# EAGLE design DisplayArray (EAGLE 9.6.2)

## Sheet 1 of 2
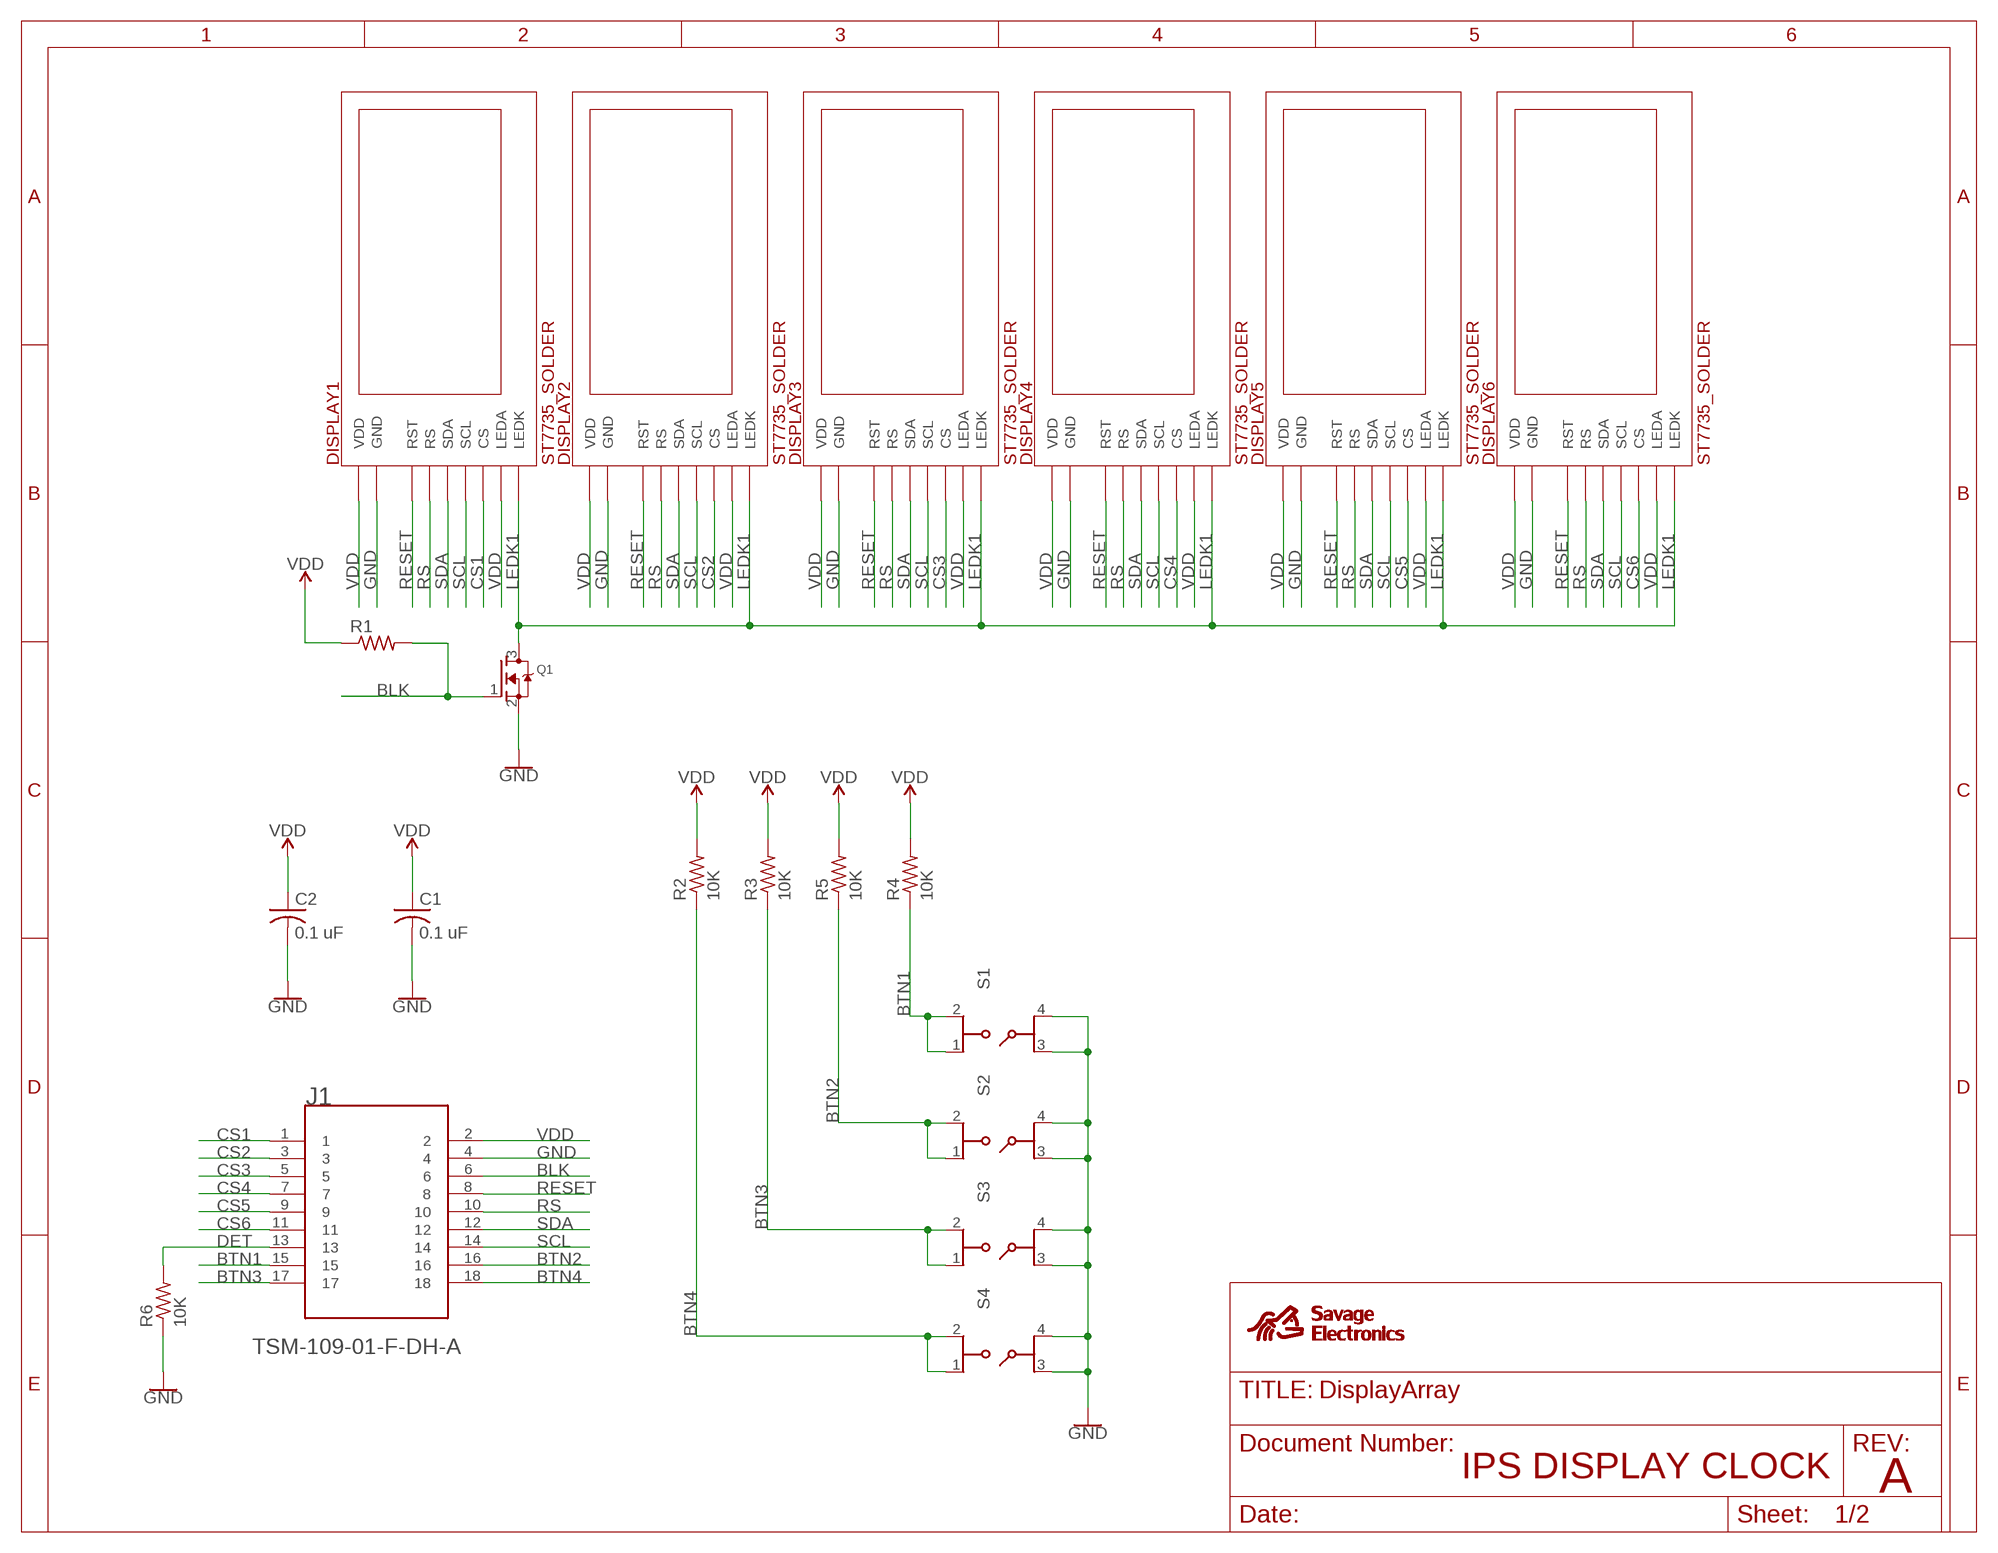
[diagram p0: schematic, sheet 1]

### Parts
C1  0.1 uF  C-USC0603  [C0603]
C2  0.1 uF  C-USC0603  [C0603]
DISPLAY1  ST7735_SOLDER  [IPSLCD096_SOLDER]
DISPLAY2  ST7735_SOLDER  [IPSLCD096_SOLDER]
DISPLAY3  ST7735_SOLDER  [IPSLCD096_SOLDER]
DISPLAY4  ST7735_SOLDER  [IPSLCD096_SOLDER]
DISPLAY5  ST7735_SOLDER  [IPSLCD096_SOLDER]
DISPLAY6  ST7735_SOLDER  [IPSLCD096_SOLDER]
J1  TSM-109-01-F-DH-A  SAMTEC-TSM-109-02-X-DH-AJ  [SAMTEC-TSM-109-02-X-DH-A]
Q1  MOSFET-NREFLOW  [SOT23]
R1  R-US_R0805  [R0805]
R2  10K  R-US_R0805  [R0805]
R3  10K  R-US_R0805  [R0805]
R4  10K  R-US_R0805  [R0805]
R5  10K  R-US_R0805  [R0805]
R6  10K  R-US_R0805  [R0805]
S1  434123025826  [434123025826]
S2  434123025826  [434123025826]
S3  434123025826  [434123025826]
S4  434123025826  [434123025826]
U$3  SE_SMALL_SILK  [SE_SMALL_SILK]

### Nets
BLK: J1.6 Q1.1(G) R1.2
BTN1: J1.15 R4.1 S1.1 S1.2
BTN2: J1.16 R5.1 S2.1 S2.2
BTN3: J1.17 R3.1 S3.1 S3.2
BTN4: J1.18 R2.1 S4.1 S4.2
CS1: DISPLAY1.7(CS) J1.1
CS2: DISPLAY2.7(CS) J1.3
CS3: DISPLAY3.7(CS) J1.5
CS4: DISPLAY4.7(CS) J1.7
CS5: DISPLAY5.7(CS) J1.9
CS6: DISPLAY6.7(CS) J1.11
DET: J1.13 R6.2
GND: C1.2 C2.2 DISPLAY1.8(GND) DISPLAY1.13(GND) DISPLAY2.8(GND) DISPLAY2.13(GND) DISPLAY3.8(GND) DISPLAY3.13(GND) DISPLAY4.8(GND) DISPLAY4.13(GND) DISPLAY5.8(GND) DISPLAY5.13(GND) DISPLAY6.8(GND) DISPLAY6.13(GND) J1.4 Q1.2(S) R6.1 S1.3 S1.4 S2.3 S2.4 S3.3 S3.4 S4.3 S4.4
LEDK1: DISPLAY1.11(LEDK) DISPLAY2.11(LEDK) DISPLAY3.11(LEDK) DISPLAY4.11(LEDK) DISPLAY5.11(LEDK) DISPLAY6.11(LEDK) Q1.3(D)
RESET: DISPLAY1.6(RST) DISPLAY2.6(RST) DISPLAY3.6(RST) DISPLAY4.6(RST) DISPLAY5.6(RST) DISPLAY6.6(RST) J1.8
RS: DISPLAY1.5(RS) DISPLAY2.5(RS) DISPLAY3.5(RS) DISPLAY4.5(RS) DISPLAY5.5(RS) DISPLAY6.5(RS) J1.10
SCL: DISPLAY1.4(SCL) DISPLAY2.4(SCL) DISPLAY3.4(SCL) DISPLAY4.4(SCL) DISPLAY5.4(SCL) DISPLAY6.4(SCL) J1.14
SDA: DISPLAY1.3(SDA) DISPLAY2.3(SDA) DISPLAY3.3(SDA) DISPLAY4.3(SDA) DISPLAY5.3(SDA) DISPLAY6.3(SDA) J1.12
VDD: C1.1 C2.1 DISPLAY1.10(VDD) DISPLAY1.12(LEDA) DISPLAY2.10(VDD) DISPLAY2.12(LEDA) DISPLAY3.10(VDD) DISPLAY3.12(LEDA) DISPLAY4.10(VDD) DISPLAY4.12(LEDA) DISPLAY5.10(VDD) DISPLAY5.12(LEDA) DISPLAY6.10(VDD) DISPLAY6.12(LEDA) J1.2 R1.1 R2.2 R3.2 R4.2 R5.2

### Notes on the sheet
- IPS DISPLAY CLOCK
- A

## Sheet 2 of 2

## Library data of the parts
C1 C2 = Adafruit:C-US: CAPACITOR, American symbol
DISPLAY1-DISPLAY6 = IPSLCD:ST7735_SOLDER
J1 = TSM-109-02-X-DH-A:SAMTEC-TSM-109-02-X-DH-A
Q1 = Adafruit:MOSFET-N: N-Channel Mosfet 2N7002E - 60V 260mA SOT23 [Digikey: 2N7002ET1GOSTR-ND] - REEL BSH103 - 30V 850mA SOT23 [Digikey: 568-5013-1-ND]
R1-R6 = Adafruit:R-US_: RESISTOR, American symbol
S1-S4 = Eagle_SWITCHES (rev18c):434123025826: 4.2 x 3.2 mm J-Bend SMD Tact Switch WS-TASV MATERIAL PROPERTIES: Cover Material Stainless Steel Actuator Material LCP Actuator Flammability Rating UL94 V-0 Actuator Color White;​ Black Frame Material LCP Frame Flammability Rating UL94 V-0 Frame Color Black Contact Material Stainless Steel Contact Plating Silver Terminal Material Copper Alloy Terminal Plating Silver ELECTRICAL PROPERTIES: Rated Current [1] 50 mA Rated Voltage 16 V (DC) Contact Resistance Initial 500 mΩ Contact Resistance After Life Test 1 Ω Insulation Resistance 100 MΩ Withstanding Voltage 250 V (AC) Bounce 10 ms MECHANICAL PROPERTIES: Operation Force 260 g;​ 160 g Life Cycle 50000 Times;​ 100000 Times GENERAL INFORMATION: Operating Temperature -40 °C up to +85 °C Storage Temperature (in original packaging) -40 °C up to +85 °C PACKAGING PROPERTIES: Packaging Tape and Reel Packaging Unit (Qty.) 2900 <http://katalog.we-online.de/media/images/v2/Family_WS-TASV-4341x30258x6_Gruppe.jpg> Details see: http://katalog.we-online.de/em/datasheet/434123025826.pdf 2017(C) Wurth Elektronik
U$3 = SE_NEWLOGO:SE_SMALL_SILK

## Board
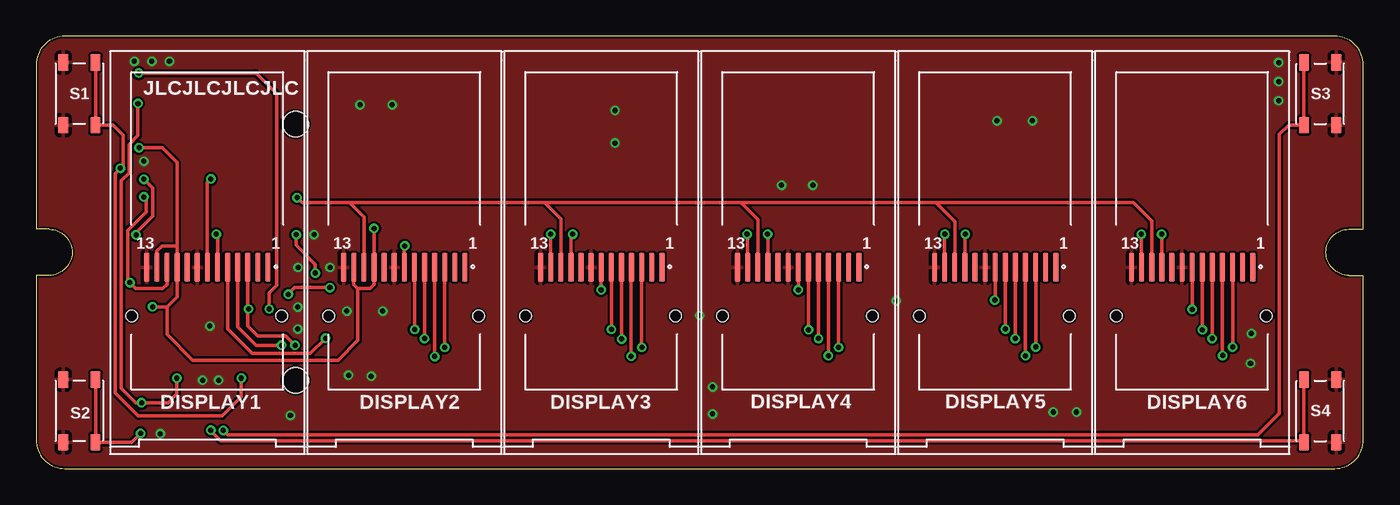
[diagram p1: board, top side]
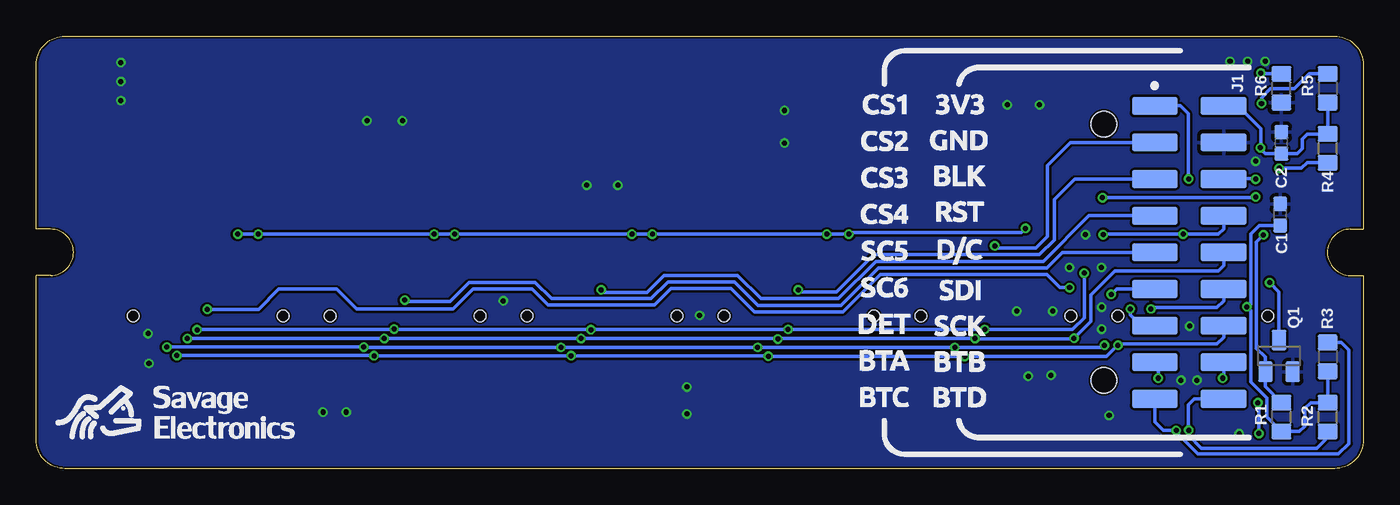
[diagram p2: board, bottom side, seen from below]

Size 92 x 30 mm. Coordinates in mm from the lower left corner, seen from the top.
Outline: 2,0 90,0 arc90 92,2 92,13.4 91,13.4 arc-180 91,16.6 92,16.6 92,28 arc90 90,30 2,30 arc90 0,28 0,16.6 0.9,16.6 arc-180 0.9,13.4 0,13.4 0,2 arc90 2,0
Copper layers (1*16): Top 0.035mm / dielectric 1.5mm / Bottom 0.035mm
Design rules "default *": minimum track width 5mil, minimum drill 0.3mm, track to track 6mil, track to pad 5mil, pad to pad 5mil, via to via 5mil, smd to smd 5mil, copper to edge 6mil, drill to drill 6mil, minimum pad ring 10mil, minimum via ring 6mil, stop-mask expansion 2mil, vias tented up to drill 20mil, thermal gap 10mil

### Footprints (pad centres in the part's own frame; a part is rotated, then mirrored left to right if it is on the bottom)
C0603 = smd 0.965 x 0.965: 1 -0.748,0; 2 0.748,0
IPSLCD096_SOLDER = smd 2 x 0.35: 1 12.96,2.55; 2 12.96,3.25; 3 12.96,3.95; 4 12.96,4.65; 5 12.96,5.35; 6 12.96,6.05; 7 12.96,6.75; 8 12.96,7.45; 9 12.96,8.15; 10 12.96,8.85; 11 12.96,9.55; 12 12.96,10.25; 13 12.96,10.95 | hole 0.8: 9.6,12; 9.6,1.6
SAMTEC-TSM-109-02-X-DH-A = smd 1.27 x 3.18: 1 -10.16,3.543; 2 -10.16,8.306; 3 -7.62,3.543; 4 -7.62,8.306; 5 -5.08,3.543; 6 -5.08,8.306; 7 -2.54,3.543; 8 -2.54,8.306; 9 0,3.543; 10 0,8.306; 11 2.54,3.543; 12 2.54,8.306; 13 5.08,3.543; 14 5.08,8.306; 15 7.62,3.543; 16 7.62,8.306; 17 10.16,3.543; 18 10.16,8.306 | hole 1.78: 8.89,0; -8.89,0
SOT23 = smd 1 x 1.4: 1 -0.95,-1.1; 2 0.95,-1.1; 3 0,1.1
R0805 = smd 1.1 x 1.4: 1 -1,0; 2 1,0
434123025826 = smd 1.168 x 0.711: 1 -2.175,1.121; 2 2.175,1.121; 3 -2.175,-1.121; 4 2.175,-1.121

### Placement (x,y rotation side)
C1  5.77,17.61 90 bottom
C2  5.69,22.59 90 bottom
DISPLAY1  18.62,1 90 top
DISPLAY2  32.27,1 90 top
DISPLAY3  45.92,1 90 top
DISPLAY4  59.58,1 90 top
DISPLAY5  73.22,1 90 top
DISPLAY6  86.88,1 90 top
J1  18,15 270 bottom
Q1  5.85,7.82 0 bottom
R1  5.68,3.57 90 bottom
R2  2.47,3.57 90 bottom
R3  2.47,7.75 270 bottom
R4  2.47,22.21 90 bottom
R5  2.47,26.38 270 bottom
R6  5.69,26.38 90 bottom
S1  3,26 270 top
S2  3,4 270 top
S3  89,26 90 top
S4  89,4 90 top
U$3  82.2,3.9 0 bottom

### Tracks (layer width: path | path; a pad name or v marks a point on that pad's centre or on a via)
BLK  (via drill 0.35)
  Top 0.254: v6.93,16.2 6.93,16.38 8.08,17.53 8.08,19.46 v7.47,20.07
  Bottom 0.254: J1.6 9.66,20.12 7.52,20.12 v7.47,20.07 | v6.93,16.2 7.42,15.72 7.42,8.35 6.8,7.73 Q1.1 6.8,5.69 R1.2
BTN1  (via drill 0.35)
  Top 0.254: v14.22,6.27 14.22,4.98 12.9,3.66 7.09,3.66 5.49,5.26 5.49,20.47 v5.84,20.83 6.04,21.03 6.04,23.11 5.33,23.82 S1.2 S1.1
  Bottom 0.254: v5.84,20.83 4.29,20.83 3.91,21.21 R4.1 | R4.1 | v14.22,6.27 14.22,7.32 14.16,7.38 J1.15
BTN2  (via drill 0.35)
  Top 0.254: v9.75,6.27 9.75,5.18 9.14,4.57 v7.32,4.57 6.91,4.57 5.92,5.56 5.92,19.96 6.45,20.5 6.45,22.48 7.06,23.09 v7.06,25.32 | S2.1 S2.2 6.63,1.82 v7.24,2.44
  Bottom 0.254: J1.16 9.69,6.33 v9.75,6.27 | R5.1 3.76,27.38 4.8,26.34 6.45,26.34 7.06,25.73 v7.06,25.32 | v7.32,4.57 7.24,4.5 v7.24,2.44
BTN3  (via drill 0.35)
  Top 0.254: S3.2 S3.1 | S3.1 | v12.98,2.64 13.28,2.34 84.69,2.34 86.18,3.83 86.18,23.18 86.82,23.82 S3.1
  Bottom 0.254: J1.17 14.46,3.23 13.87,2.64 v12.98,2.64 12.98,2.52 11.48,1.02 1.73,1.02 1.02,1.73 1.02,8.23 1.53,8.75 R3.1
BTN4  (via drill 0.35)
  Top 0.254: S4.2 S4.1 87.78,1.93 12.8,1.93 12.12,2.62 v12.12,2.67
  Bottom 0.254: J1.18 11.73,4.84 12.14,4.42 12.14,2.69 v12.12,2.67 12.12,2.31 11.23,1.42 3.22,1.42 2.47,2.17 R2.1
CS1  (via drill 0.35)
  Top 0.254: v12.12,20.09 11.88,19.85 DISPLAY1.7
  Bottom 0.254: J1.1 12.68,25.16 12.14,24.62 12.14,20.12 v12.12,20.09
CS2  (via drill 0.35)
  Top 0.254: DISPLAY2.7 25.52,15.42 v25.55,15.44
  Bottom 0.254: v25.55,15.44 25.4,15.29 22.71,15.29 21.89,16.1 21.89,21.03 20.31,22.62 J1.3
CS3  (via drill 0.35)
  Top 0.254: v39.17,12.39 v39.17,12.4 DISPLAY3.7
  Bottom 0.254: J1.5 20,20.08 21.44,18.64 21.44,15.85 22.45,14.83 33.93,14.83 36.52,12.24 39.01,12.24 v39.17,12.39
CS4  (via drill 0.35)
  Top 0.254: DISPLAY4.7 v52.83,12.4 v52.83,12.39
  Bottom 0.254: v52.83,12.39 52.65,12.22 49.66,12.22 48.46,13.41 43.38,13.41 41.76,11.79 36.37,11.79 33.78,14.38 22.2,14.38 19.04,17.54 J1.7
CS5  (via drill 0.35)
  Top 0.254: DISPLAY5.7 66.47,11.71 v66.45,11.68
  Bottom 0.254: J1.9 20.86,15 21.95,13.92 33.63,13.92 36.22,11.33 41.96,11.33 43.59,12.95 48.21,12.95 49.38,11.79 56.29,11.79 57.4,12.9 61.98,12.9 63.3,11.58 66.34,11.58 v66.45,11.68
CS6  (via drill 0.35)
  Top 0.254: DISPLAY6.7 80.12,11.06 v80.14,11.05 | v20.36,12.55 17.93,12.55 v17.48,12.09
  Bottom 0.254: v17.48,12.09 17.11,12.46 J1.11 | v80.14,11.05 76.58,11.05 75.18,12.45 71.17,12.45 69.8,11.07 63.09,11.07 61.72,12.45 57.61,12.45 56.52,11.35 49.15,11.35 48.01,12.5 43.84,12.5 42.22,10.87 36.07,10.87 33.48,13.46 21.94,13.46 21.02,12.55 v20.36,12.55
DET  (via drill 0.35)
  Top 0.254: v7.11,27.43 15.24,27.43 16.66,26.01 16.66,12.7 16.15,12.19 v16.15,11.07
  Bottom 0.254: R6.2 7.06,27.38 v7.11,27.43 | J1.13 15.41,9.92 16.15,10.67 v16.15,11.07
GND  (via drill 0.35)
  other vias: 6.81,28.24 8.03,28.24 9.25,28.24 22.45,25.24 24.68,25.24 51.67,19.66 53.84,19.66 66.6,24.12 69.06,24.12 86.13,25.52 70.5,3.92 72.11,3.92 21.65,6.48 23.24,6.41 17.63,3.69 46.89,3.79 46.89,5.66 84.18,7.3 84.24,9.36 40.13,24.84 40.13,22.58 59.63,11.64 46.01,10.62 19.27,16.23 21.54,10.92 18.15,13.95 12.04,9.89 11.53,6.13 12.65,6.13 8.61,2.42 20.37,13.95 18.14,9.68 18.14,11.21 86.13,26.84 86.13,28.16 7.47,21.32 24.03,10.92
  pour Top (rank 2): 2,0 90,0 arc90 92,2 92,28 arc90 90,30 2,30 arc90 0,28 0,2 arc90
  pour Bottom: 2,0 90,0 arc90 92,2 92,28 arc90 90,30 2,30 arc90 0,28 0,2 arc90
LEDK1  (via drill 0.35)
  Top 0.254: DISPLAY2.11 22.73,17.46 21.79,18.39 21.84,18.44 | DISPLAY6.11 77.33,17.16 76.05,18.44 62.38,18.44 | 62.38,18.44 48.87,18.44 | 48.87,18.44 35.26,18.44 | DISPLAY3.11 36.38,17.32 35.26,18.44 | DISPLAY4.11 50.02,17.29 48.87,18.44 | DISPLAY5.11 63.67,17.15 62.38,18.44 | 35.26,18.44 21.84,18.44 | v7.47,18.85 7.62,18.69 7.62,17.78 6.35,16.51 6.35,13.06 v6.5,12.9 6.91,12.5 8.79,12.5 9.07,12.78 DISPLAY1.11 | 21.84,18.44 18.44,18.44 v18.09,18.8
  Bottom 0.254: v7.47,18.85 7.52,18.8 v18.09,18.8 | Q1.3 5.85,12.25 v6.5,12.9
RESET  (via drill 0.35)
  Top 0.254: DISPLAY6.6 80.83,9.65 v80.85,9.63 | DISPLAY5.6 v67.17,9.69 v67.18,9.68 | DISPLAY4.6 53.52,9.64 v53.54,9.63 | DISPLAY3.6 v39.88,9.65 | DISPLAY2.6 26.23,9.66 v26.24,9.65 | v19.36,13.56 19.36,14.17 18.03,15.49 v18.03,16.23 | v12.5,16.26 12.52,16.26 12.57,16.2 DISPLAY1.6
  Bottom 0.254: J1.8 9.69,16.62 10.06,16.26 v12.5,16.26 18.01,16.26 v18.03,16.23 | v80.85,9.63 80.82,9.65 67.16,9.65 v67.18,9.68 67.21,9.65 53.57,9.65 v53.54,9.63 53.52,9.65 v39.88,9.65 v26.24,9.65 20.17,9.65 19.36,10.46 v19.36,13.56
RS  (via drill 0.35)
  Top 0.254: DISPLAY6.5 81.53,11.29 81.52,11.29 v81.52,9.02 | DISPLAY5.5 v67.88,9.02 v67.87,9.02 | DISPLAY4.5 v54.23,9.02 | DISPLAY3.5 40.58,9.01 v40.59,8.99 | DISPLAY2.5 v26.93,9.02 v26.92,9.02 | DISPLAY1.5 13.28,9.69 14.99,7.98 19,7.98 v20.07,9.04
  Bottom 0.254: v81.52,9.02 v67.87,9.02 v54.23,9.02 40.62,9.02 v40.59,8.99 40.56,9.02 v26.92,9.02 26.9,8.99 20.12,8.99 v20.07,9.04 18.9,10.21 18.9,12.04 17.22,13.72 10.06,13.72 9.69,14.08 J1.10
SCL  (via drill 0.35)
  Top 0.254: DISPLAY6.4 82.22,7.87 v82.25,7.85 | DISPLAY5.4 v68.58,7.83 v68.58,7.82 | DISPLAY4.4 54.92,7.83 v54.91,7.82 | DISPLAY3.4 41.25,13.94 v41.25,7.8 | v27.64,7.77 27.62,7.78 DISPLAY2.4 | DISPLAY1.4 13.97,9.82 15.24,8.56 v17.02,8.56
  Bottom 0.254: J1.14 9.69,9.1 10.16,8.64 16.94,8.64 v17.02,8.56 17.04,8.56 17.83,7.77 v27.64,7.77 41.25,7.77 | v82.25,7.85 68.61,7.85 v68.58,7.82 v54.91,7.82 41.38,7.82 41.33,7.77 41.25,7.77 | v41.25,7.8 41.25,7.77
SDA  (via drill 0.35)
  Top 0.254: DISPLAY6.3 82.95,13.94 v82.95,8.43 v82.94,8.43 | DISPLAY5.3 69.3,13.94 69.3,8.5 69.29,8.49 v69.29,8.43 | DISPLAY4.3 v55.62,8.41 v55.63,8.41 | v41.99,8.41 41.98,8.42 DISPLAY3.3 | DISPLAY2.3 v28.32,8.41 | DISPLAY1.3 14.68,11.07 v14.73,11.07 14.68,11.02 14.68,9.91 15.37,9.22 17.28,9.22 v17.94,8.56
  Bottom 0.254: v82.94,8.43 v69.29,8.43 69.27,8.41 v55.63,8.41 v41.99,8.41 v28.32,8.41 18.09,8.41 v17.94,8.56 | J1.12 9.69,11.64 10.16,11.18 14.63,11.18 v14.73,11.07
VDD  (via drill 0.35)
  Top 0.254: v23.42,16.66 v23.43,16.66 DISPLAY2.10 23.43,12.76 23.16,12.5 22.3,12.5 | v78.02,16.25 v78.03,16.25 DISPLAY6.10 | DISPLAY6.12 76.6,14.48 v76.6,16.25 v76.61,16.26 | v64.41,16.26 64.38,16.22 DISPLAY5.10 | DISPLAY5.12 62.98,16.24 v62.99,16.26 | v50.7,16.26 50.73,16.23 DISPLAY4.10 | DISPLAY4.12 49.33,16.21 v49.28,16.26 | DISPLAY3.10 37.08,16.14 v37.19,16.26 | v35.66,16.26 35.67,16.24 DISPLAY3.12 | 9.09,11.23 9.78,11.91 DISPLAY1.10 9.78,15.44 | 9.09,11.23 v8.08,11.23 | DISPLAY2.12 22.02,12.77 22.3,12.5 | DISPLAY1.12 8.38,15.08 8.74,15.44 9.78,15.44 | 22.3,12.5 22.3,8.89 20.93,7.52 10.87,7.52 9.09,9.3 9.09,11.23 | v7.13,22.25 8.74,22.25 9.78,21.21 9.78,15.44
  Bottom 0.254: J1.2 8.7,25.16 7.11,23.57 7.11,22.25 v7.13,22.25 7.13,22.17 6.81,21.84 C2.1 4.58,21.84 4.24,22.19 4.24,22.86 3.89,23.21 R4.2 R5.2 | v23.42,16.66 23.72,16.36 35.56,16.36 v35.66,16.26 v37.19,16.26 v49.28,16.26 v50.7,16.26 v62.99,16.26 v64.41,16.26 v76.61,16.26 v76.61,16.25 v78.02,16.25 | R3.2 R2.2 3.66,4.57 4.06,4.17 4.06,2.95 4.44,2.57 R1.1 6.7,3.59 6.7,4.91 7.82,6.03 7.82,10.97 v8.08,11.23 7.98,11.23 7.82,11.38 7.82,16.26 7.21,16.86 C1.1

### Text on the board
tPlace: JLCJLCJLCJLC